# EAGLE design tvbgone-adj (EAGLE 5.10)
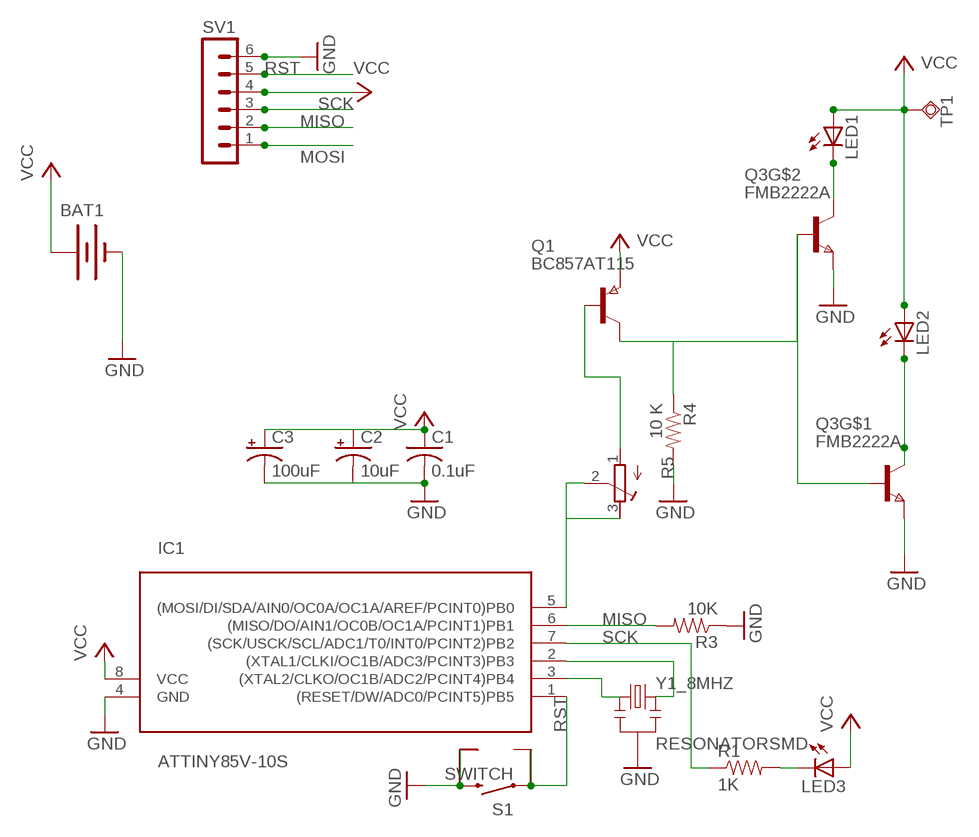
[diagram p0: schematic, sheet 1]

## Parts
BAT1  BATTERYCR123A  [BATTERY_CR123A]
C1  0.1uF  C-USC0805K  [C0805K]
C2  10uF  CAP_POL1206  [EIA3216]
C3  100uF  CAP_POL7343  [EIA7343]
IC1  ATTINY85V-10S  [SOIC8]
LED1  LEDSIDEIR  [SIDE_IR_NSL]
LED2  LEDSIDEIR  [SIDE_IR_NSL]
LED3  LEDCHIPLED_1206  [CHIPLED_1206]
Q1  BC857AT115  PNPSOT323SOT416  [SOT416]
Q3  FMB2222A  DUALNPN  [SSOT6]
R1  1K  RESISTOR1206  [1206]
R3  10K  RESISTOR  [0805]
R4  10 K  RESISTOR  [0805]
R5  R-TRIMM3103  [RTRIM3103]
S1  SWITCH  SWITCH-MOMENTARY-2SMD  [TACTILE_SWITCH_SMD]
SV1  CON-LSTB_MA06-1  [CON-LSTB_MA06-1]
TP1  TPSQTP07SQ  [TP07SQ]
Y1_8MHZ  RESONATORSMD  [RESONATOR-SMD]

## Nets
GND: BAT1.- C1.2 C2.C(-) C3.C(-) IC1.4(GND) Q3.2(E) Q3.5(E) R3.1 R4.2 S1.3 S1.4 SV1.6 Y1_8MHZ.2
MISO: IC1.6((MISO/DO/AIN1/OC0B/OC1A/PCINT1)PB1) R3.2 SV1.2
MOSI: IC1.5((MOSI/DI/SDA/AIN0/OC0A/OC1A/AREF/PCINT0)PB0) R5.2(S) R5.3(A) SV1.1
N$1: IC1.3((XTAL2/CLKO/OC1B/ADC2/PCINT4)PB4) Y1_8MHZ.1
N$2: IC1.2((XTAL1/CLKI/OC1B/ADC3/PCINT3)PB3) Y1_8MHZ.3
N$3: LED3.C R1.2
N$4: LED1.C Q3.4(C)
N$5: LED2.C Q3.6(C)
N$6: Q1.2(B) R5.1(E)
N$7: Q1.1(C) Q3.1(B) Q3.3(B) R4.1
RST: IC1.1((RESET/DW/ADC0/PCINT5)PB5) S1.1 S1.2 SV1.5
SCK: IC1.7((SCK/USCK/SCL/ADC1/T0/INT0/PCINT2)PB2) R1.1 SV1.3
VCC: BAT1.+ C1.1 C2.A(+) C3.A(+) IC1.8(VCC) LED1.A LED2.A LED3.A Q1.3(E) SV1.4 TP1.TP

## Library data of the parts
BAT1 = SparkFun:BATTERY: Battery Holders Various common sizes : AA, AAA, 20mm coin cell and 12mm coin cell.
C1 = rcl-ez:C-US: CAPACITOR, American symbol
C2 C3 = SparkFun:CAP_POL: Capacitor Polarized These are standard SMD and PTH capacitors. Normally 10uF, 47uF, and 100uF in electrolytic and tantalum varieties. Always verify the external diameter of the through hole cap, it varies with capacity, voltage, and manufacturer. The EIA devices should be standard.
IC1 = avr:ATTINY85: MICROCONTROLLER 8 Kbytes FLASH 512 bytes EEPROM 512 bytes RAM 4-channel 10 bit ADC USI
LED1 LED2 = tvbgone3:LED: LED
LED3 = minimidi:LED: LED
Q1 = zetex:PNPSOT323: PNP TRANSISTOR
Q3 = fairchild-semic:DUALNPN
R1 R3 R4 = SparkFun:RESISTOR: Resistor Basic schematic elements and footprints for 0603, 1206, and PTH 1/10th watt (small) resistors.
R5 = resistor:R-TRIMM: Trimm resistor
S1 = SparkFun:SWITCH-MOMENTARY-2
SV1 = NSL:CON-LSTB_MA06-1: PIN HEADER
TP1 = testpad:TPSQ: Test pad
Y1_8MHZ = SparkFun:RESONATOR: Resonator Small SMD resonator. This is the itty bitty 10/20MHz resonators with built in caps. CSTCE10M0G55 and CSTCE20M0V53. Footprint has been reviewed closely but hasn't been tested yet.

## Board
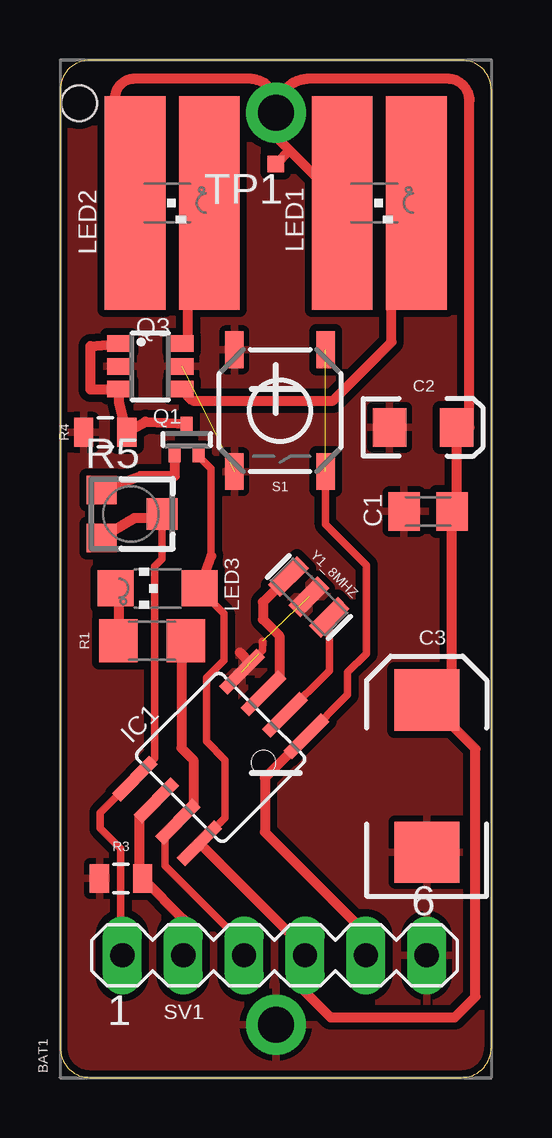
[diagram p1: board, top side]

Size 18 x 42.4 mm. Coordinates in mm from the lower left corner, seen from the top.
Outline: 16.73,0 arc90 18,1.27 18,41.13 arc90 16.73,42.4 1.27,42.4 arc90 0,41.13 0,1.27 arc90 1.27,0 16.73,0
Copper layers (1*16): Top 0.0356mm / dielectric 1.5011mm / Bottom 0.0356mm
Design rules "SparkFun-mod": minimum track width 8mil, minimum drill 20mil, track to track 12mil, track to pad 12mil, pad to pad 8mil, via to via 8mil, smd to smd 8mil, copper to edge 12mil, drill to drill 8mil, minimum pad ring 12mil, minimum via ring 10mil, stop-mask expansion 4mil, vias tented up to drill 25mil, thermal gap 10mil

### Footprints (pad centres in the part's own frame; a part is rotated, then mirrored left to right if it is on the bottom)
BATTERY_CR123A = drill 1.5 pad 2.5 round: + 19,0; - -19,0 | hole 1.5: 19.4,8.2
C0805K = smd 1.3 x 1.6: 1 -1,0; 2 1,0
EIA3216 = smd 1.4 x 1.6: A 1.4,0; C -1.4,0
EIA7343 = smd 2.55 x 2.7: A 3.17,0; C -3.17,0
SOIC8 = smd 0.5 x 2.2: 1 -1.905,-3.154; 2 -0.645,-3.154; 3 0.625,-3.154; 4 1.895,-3.154; 5 1.905,3.154; 6 0.635,3.154; 7 -0.635,3.154; 8 -1.905,3.154
SIDE_IR_NSL@1 = smd 2.54 x 8.89: A -1.547,0; C 1.547,0
CHIPLED_1206 = smd 1.5 x 1.5: A 0,-1.75; C 0,1.75
SOT416 = smd 0.6 x 0.5: 1 -0.65,0; 2 0.65,-0.5; 3 0.65,0.5
SSOT6 = smd 0.69 x 0.99: 1 -0.95,-1.3; 2 0,-1.3; 3 0.95,-1.3; 4 0.95,1.3; 5 0,1.3; 6 -0.95,1.3
1206 = smd 1.6 x 1.8: 1 -1.4,0; 2 1.4,0
0805 = smd 0.8 x 1.2: 1 -0.9,0; 2 0.9,0
RTRIM3103 = smd 1.2 x 1.25: 1 -1,-1.225; 3 1,-1.225 | smd 1.3 x 1.3: 2 0,1.3
TACTILE_SWITCH_SMD = smd 1.524 x 0.762: 1 -2.54,1.905; 2 2.54,1.905; 3 -2.54,-1.905; 4 2.54,-1.905
CON-LSTB_MA06-1 = drill 1.016 long: 1 -6.35,0; 2 -3.81,0; 3 -1.27,0; 4 1.27,0; 5 3.81,0; 6 6.35,0
TP07SQ = smd 0.7 x 0.7: TP 0,0
RESONATOR-SMD = smd 0.7 x 1.7: 1 -1.2,0; 2 0,0; 3 1.2,0

### Placement (x,y rotation side)
BAT1  9,21.2 90 top
C1  15.35,23.59 180 top
C2  15.15,27.09 0 top
C3  15.3,12.56 90 top
IC1  6.7,13.34 135 top
LED1  [SIDE_IR_NSL@1]  13.32,36.44 0 top
LED2  [SIDE_IR_NSL@1]  4.68,36.44 0 top
LED3  4.07,20.39 90 top
Q1  5.29,26.58 270 top
Q3  3.77,29.63 270 top
R1  3.84,18.2 180 top
R3  2.55,8.3 0 top
R4  1.89,26.89 180 top
R5  2.95,23.49 270 top
S1  9.18,27.79 270 top
SV1  8.95,5.1 0 top
TP1  9,38.07 180 top
Y1_8MHZ  10.38,20.03 315 top

### Tracks (layer width: path | path; a pad name or v marks a point on that pad's centre or on a via)
GND  (4 unrouted)
  Top 0.305: 8.29,17.64 8.44,17.8 8.44,18.18
  Top 0.406: 7.5,17.72 7.93,17.29
  pour Top: -0.04,42.28 18.22,42.28 18.22,0.12 -0.04,-0.09
MISO
  Top 0.406: SV1.2 5.14,6.61 R3.2 3.31,8.43 3.31,10.89 3.39,10.96 3.42,10.96 IC1.6
MOSI
  Top 0.305: SV1.1 2.52,5.17 2.52,9.54 1.68,10.38 1.68,11.04 3.1,12.46 | 3.1,12.46 IC1.5 | 3.1,12.46 3.95,13.3 3.95,21.3 4.25,21.61 4.25,22.93 R5.2
  Top 0.406: R5.3 3.11,23.31 4.25,23.31 4.25,22.93
N$1
  Top 0.406: IC1.3 9.15,16.68 9.15,18.41 8.47,19.09 8.47,19.81 Y1_8MHZ.1
N$2
  Top 0.305: Y1_8MHZ.3 11.23,16.96 IC1.2
N$3
  Top 0.305: LED3.C 2.39,20.32
  Top 0.406: R1.2 2.44,20.27 LED3.C
N$4
  Top 0.406: Q3.4 5.54,28.21 11.39,28.21 13.83,30.65 13.83,32.68 14.87,33.72 LED1.C
N$5
  Top 0.406: LED2.C 5.34,35.55 5.34,30.58 Q3.6
N$6
  Top 0.406: R5.1 3.36,25.06 4.79,25.06 Q1.2
N$7
  Top 0.406: Q1.1 3.57,27.33 R4.1 2.47,28.17 Q3.3 2.45,28.67 1.28,28.67 1.28,30.48 Q3.1
RST  (1 unrouted)
  Top 0.305: 11.08,24.79 S1.2 11.08,23.06 12.79,21.35 12.79,17.67 12,16.88 12,15.95 IC1.1
  Top 0.406: SV1.5 12.76,6.01 8.54,10.23 8.54,12.49 IC1.1
SCK
  Top 0.305: SV1.3 7.68,5.53 4.38,8.83 4.38,10.12 IC1.7
  Top 0.406: IC1.7 4.92,10.72 5.57,11.37 5.57,13.22 5.06,13.73 5.06,17.89 R1.1
VCC
  Top 0.305: LED3.A 6.31,21.74 6.31,25.37 5.79,25.88 Q1.3 | 5.8,20.36 6.84,19.32 6.84,17.39 6.1,16.65 6.1,14.01 6.89,13.22 6.89,10.84 IC1.8
  Top 0.406: 9.57,38.64 9,39.21 BAT1.+ | 9.57,38.64 LED1.A | BAT1.+ arc-90 10.42,41.62 16.16,41.62 arc-90 17.08,40.71 17.08,27.09 C2.A 16.55,23.78 arc-90 C1.1 16.35,16.79 C3.A 17.33,13.7 17.33,3.37 16.47,2.51 11.29,2.51 10.22,3.57 SV1.4 10.22,5.36 IC1.8 | BAT1.+ 9,40.45 9.05,40.45 arc90 7.88,41.62 3.11,41.62 arc90 2.29,40.81 2.29,39.23 arc-90 3.13,38.39 LED2.A | 9.57,38.64 TP1.TP | 6.31,21.74 5.8,20.36